# EAGLE design Rele-12V-FritzenLab-Testes (EAGLE 8.6.0)
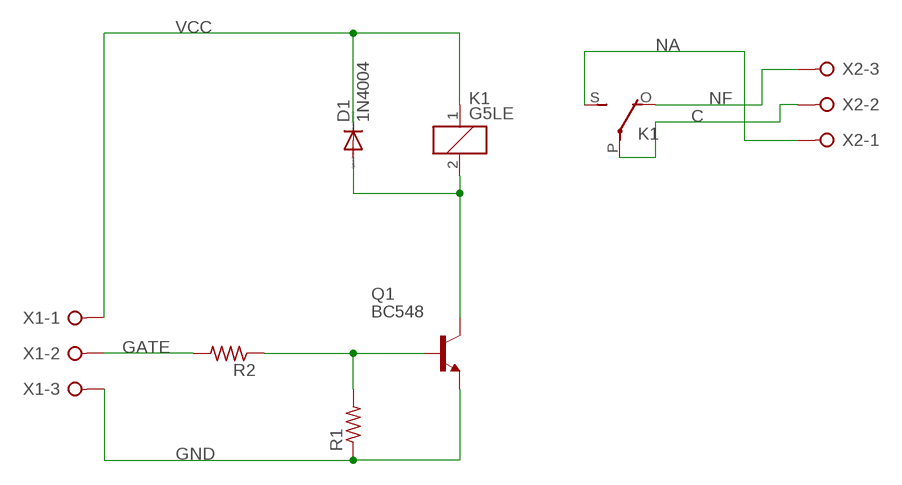
[diagram p0: schematic, sheet 1]

## Parts
D1  1N4004  [DO41-10]
K1  G5LE  [G5LE]
Q1  BC548  [TO92-EBC]
R1  R-US_0207/10  [0207/10]
R2  R-US_0207/10  [0207/10]
X1  W237-3E  [W237-3E]
X2  W237-3E  [W237-3E]

## Nets
C: K1.P(2:P) X2.2
GATE: R2.2 X1.2
GND: Q1.E R1.1 X1.3
N$4: Q1.B R1.2 R2.1
N$5: D1.A K1.2 Q1.C
NA: K1.S(2:S) X2.1
NF: K1.O(2:O) X2.3
VCC: D1.C K1.1 X1.1

## Library data of the parts
D1 = diode:1N4004: DIODE general purpose rectifier, 1 A
K1 = relay:G5LE: RELAY 1 x switch, 10 A/120 V AC, 8 A/30 V DC, Omron; OC_FARNELL: unknown; OC_NEWARK: unknown
Q1 = transistor-npn:BC548*: NPN Transistor
R1 R2 = rcl:R-US_: RESISTOR, American symbol; SPICEPREFIX: R
X1 X2 = con-wago-508:W237-3E: WAGO SREW CLAMP; OC_FARNELL: unknown; OC_NEWARK: unknown

## Board
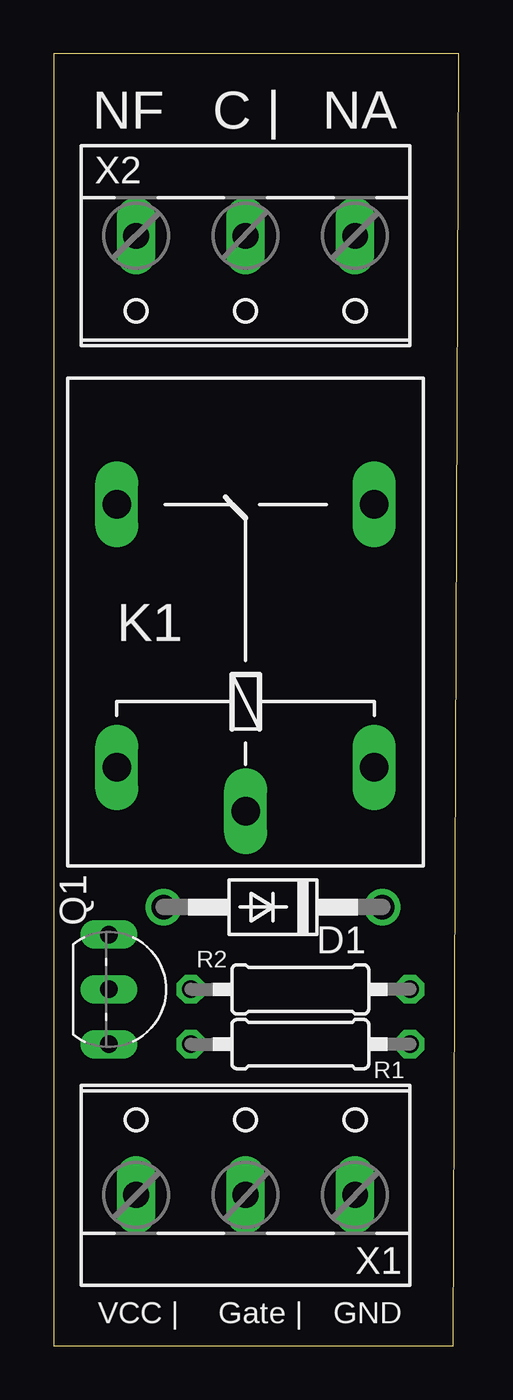
[diagram p1: board, top side]
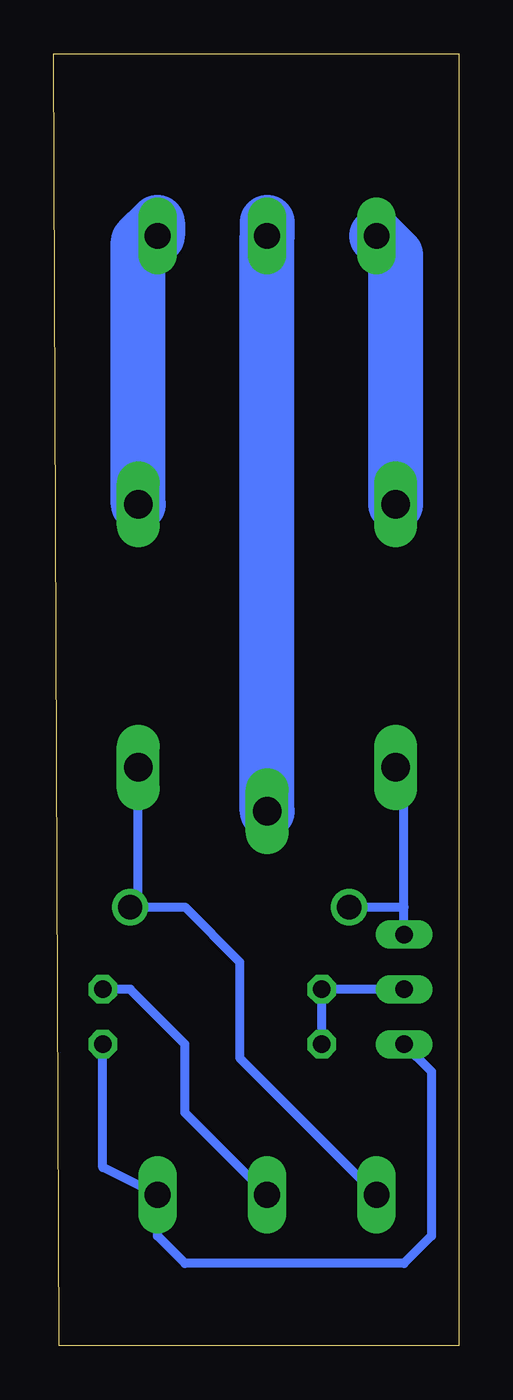
[diagram p2: board, bottom side, seen from below]

Size 18.78 x 59.87 mm. Coordinates in mm from the lower left corner, seen from the top.
Outline: 0,0 18.52,0 18.78,59.87 0,59.87 0,0
Copper layers (1*16): Top 0.035mm / dielectric 1.5mm / Bottom 0.035mm
Design rules "default *": minimum track width 6mil, minimum drill 0.35mm, track to track 10mil, track to pad 6mil, pad to pad 6mil, via to via 6mil, smd to smd 6mil, copper to edge 40mil, drill to drill 6mil, minimum pad ring 10mil, minimum via ring 8mil, stop-mask expansion 4mil, vias tented up to drill 0mil, thermal gap 10mil

### Footprints (pad centres in the part's own frame; a part is rotated, then mirrored left to right if it is on the bottom)
DO41-10 = drill 1.118: A 5.08,0; C -5.08,0
G5LE = drill 1.321 long: 1 -7.493,-5.969; 2 -7.493,5.969; O 4.699,5.969; P -9.525,0; S 4.699,-5.969
TO92-EBC = drill 0.813 long: B 0,-1.27; C -2.54,-1.27; E 2.54,-1.27
0207/10 = drill 0.813 octagon: 1 -5.08,0; 2 5.08,0
W237-3E = drill 1.194 long: 1 -5.08,-0.635; 2 0,-0.635; 3 5.08,-0.635

### Placement (x,y rotation side)
D1  10.16,20.32 180 top
K1  8.89,34.29 90 top
Q1  3.81,16.51 270 top
R1  11.43,13.97 180 top
R2  11.43,16.51 0 top
X1  8.89,7.62 0 top
X2  8.89,50.8 180 top

### Tracks (layer width: path | path; a pad name or v marks a point on that pad's centre or on a via)
C
  Bottom 2.54: K1.P X2.2 8.89,52.07
GATE
  Bottom 0.406: R2.2 15.24,16.51 12.7,13.97 12.7,10.79 X1.2
GND
  Bottom 0.406: R1.1 16.51,8.26 X1.3 13.97,5.08 12.7,3.81 2.54,3.81 1.27,5.08 1.27,12.7 Q1.E
N$4
  Bottom 0.406: R1.2 R2.1 Q1.B
N$5
  Bottom 0.406: Q1.C 2.54,20.32 | 2.54,20.32 2.54,26.42 K1.2 | D1.A 2.54,20.32
NA
  Bottom 2.54: K1.S 14.86,51.18 13.97,52.07 X2.1
NF
  Bottom 2.54: K1.O 2.92,50.55 X2.3
VCC
  Bottom 0.406: X1.1 10.16,13.34 10.16,17.78 12.7,20.32 D1.C 14.86,20.7 K1.1

### Text on the board
tNames: NF | C | | NA | VCC | | Gate | | GND